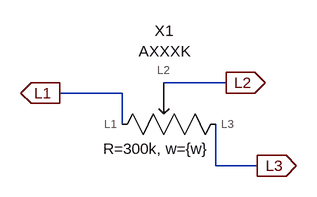
[diagram p0: schematic A300K.asc]
A300K.asc, the LTspice schematic file:
Version 4
SHEET 1 880 680
WIRE 144 272 48 272
WIRE -16 288 -112 288
WIRE -16 336 -16 288
WIRE 128 400 128 336
WIRE 192 400 128 400
FLAG 144 272 L2
IOPIN 144 272 Out
FLAG -112 288 L1
IOPIN -112 288 Out
FLAG 192 400 L3
IOPIN 192 400 Out
SYMBOL Base_AxxxK 48 272 R0
WINDOW 39 -12 102 Center 2
SYMATTR InstName X1
SYMATTR SpiceLine R=300k, w={w}

The netlist it stands for:
* A300K.asc
XX1 L1 L2 L3 AXXXK R=300k, w={w}  ; pins L1 L2 L3
.backanno
.end